# EasyEDA schematic STM32F103C8T6.json
TITLE: STM32F103C8T6; REV: 1.0; Date: 2023-01-12; Sheet: 1/1; Drawn By: Saw123; Company: Your Company
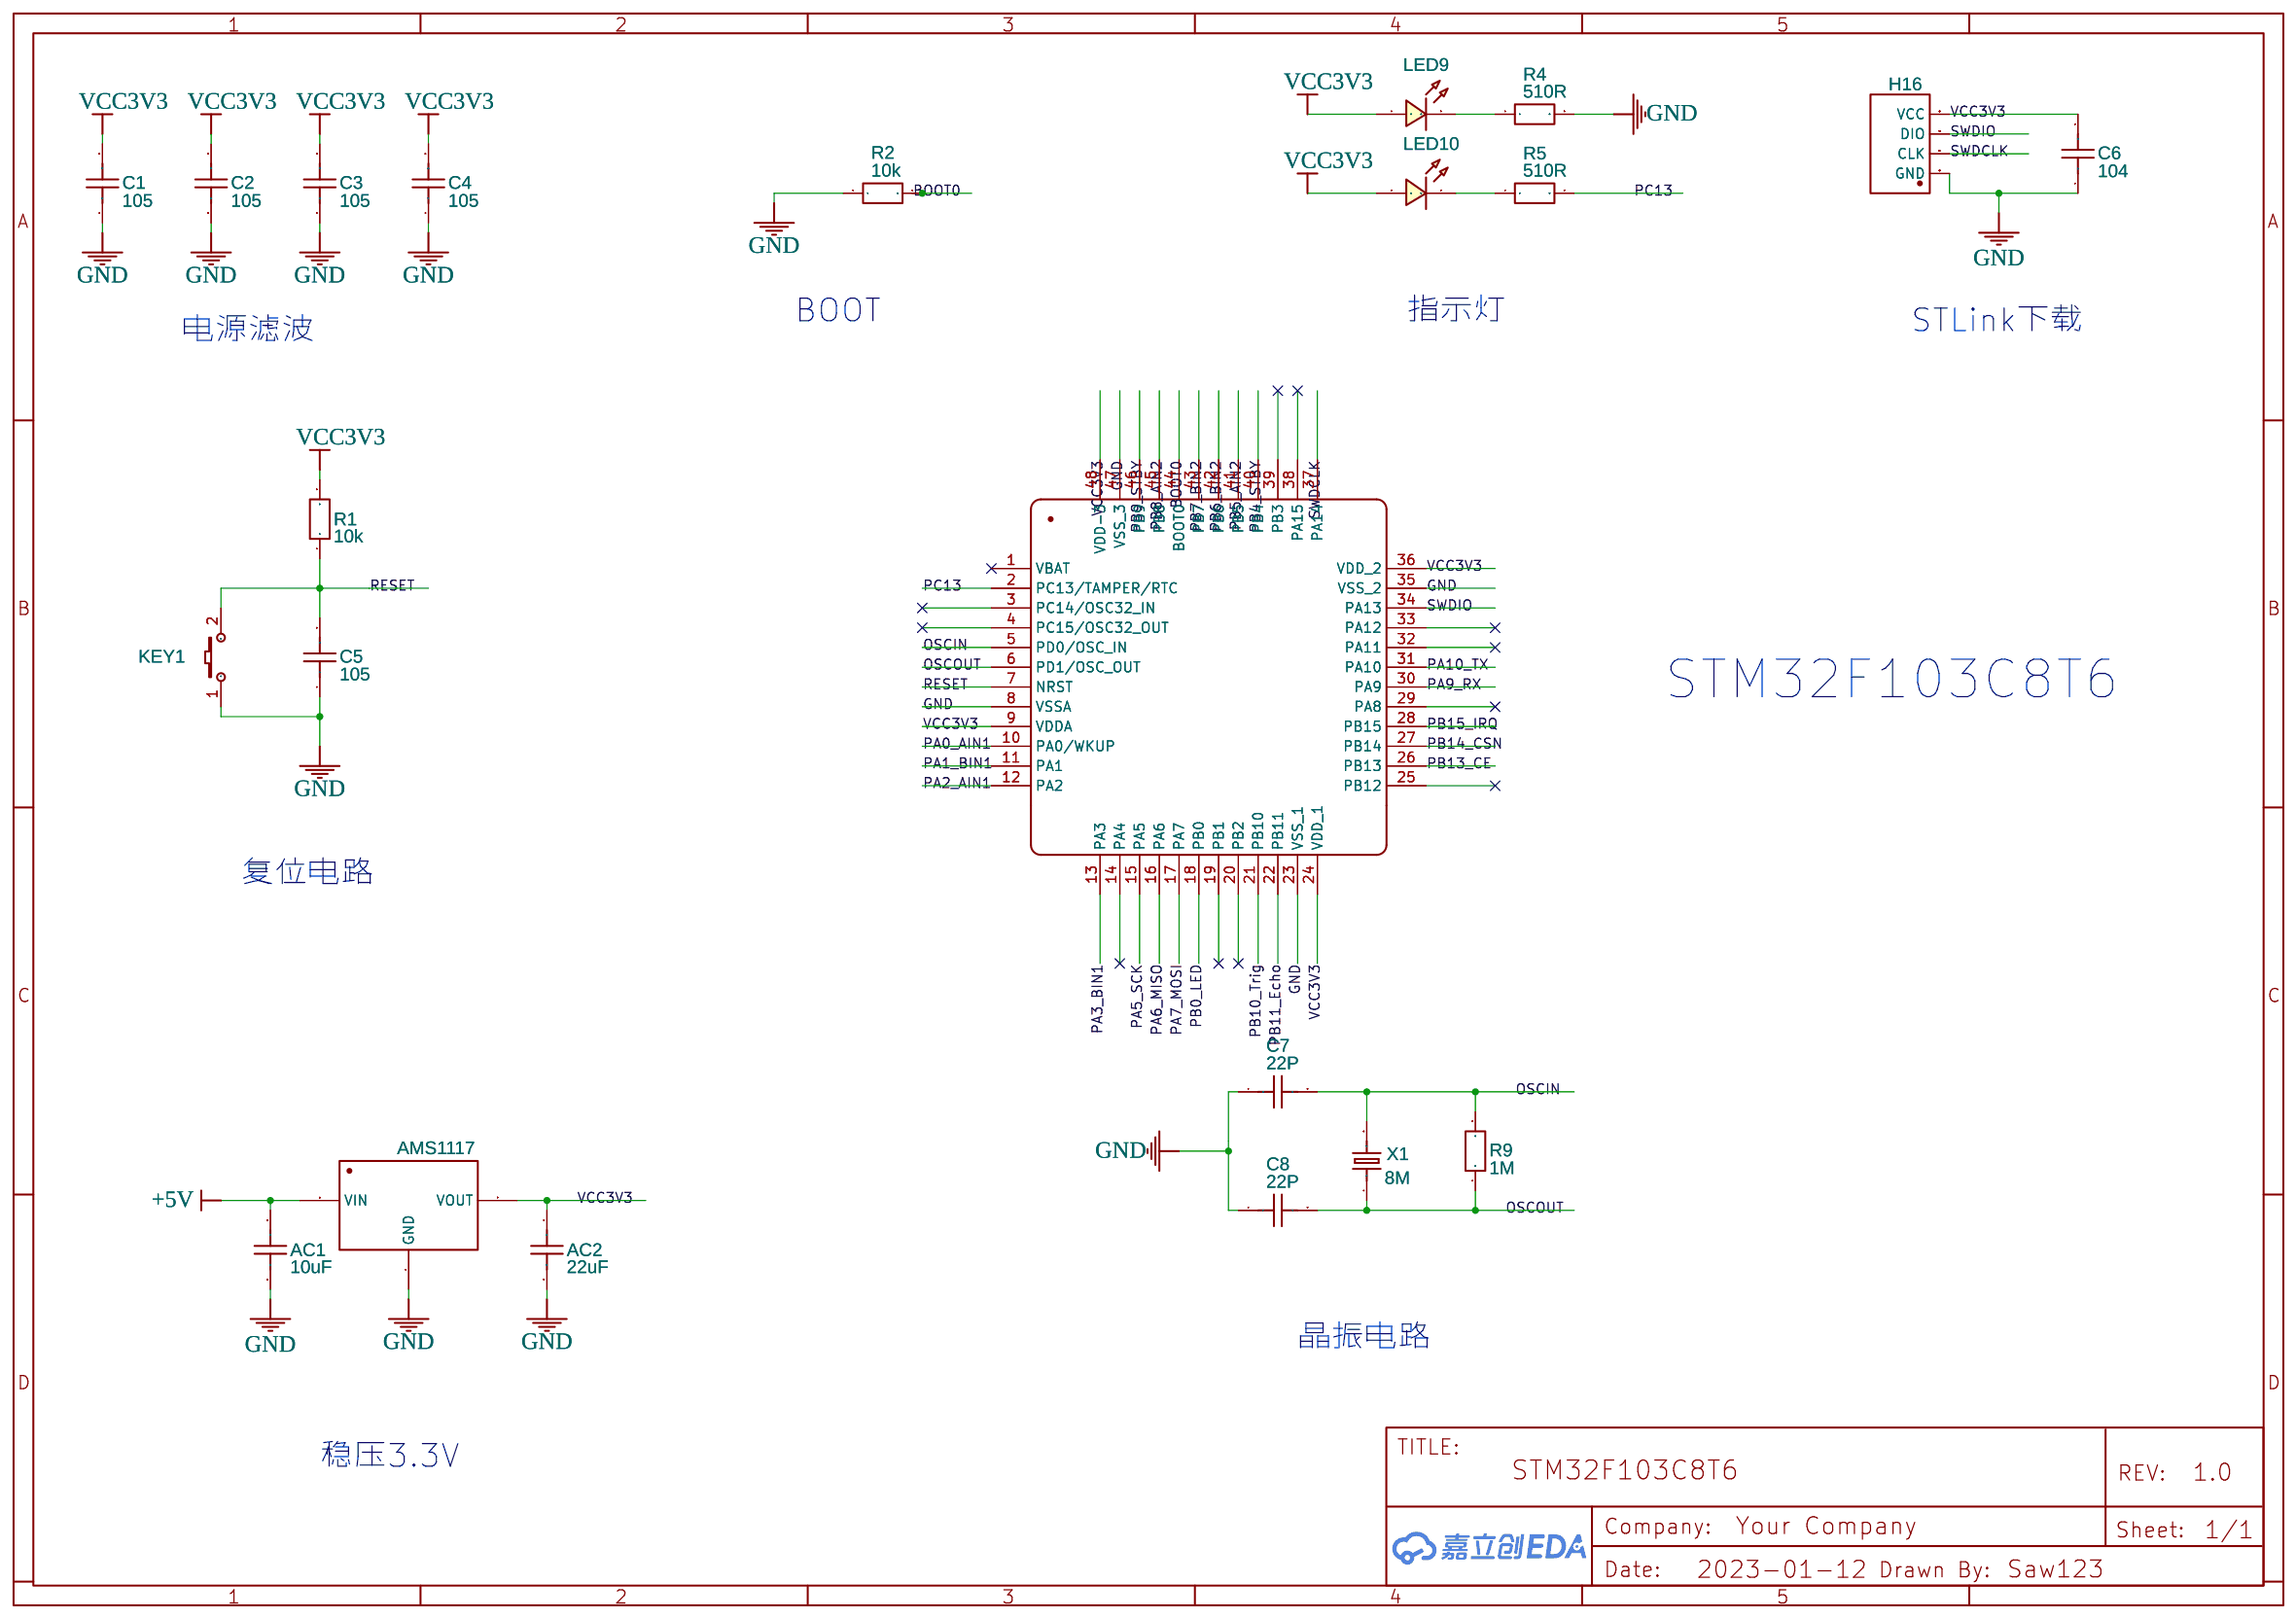
[diagram p0: schematic sheet]

## Parts
AC1  10uF  [C0805]
AC2  22uF  [C0805]
AU1  AMS1117  [AMS1117-3.3]
C1  105  [C0805]
C2  105  [C0805]
C3  105  [C0805]
C4  105  [C0805]
C5  105  [C0805]
C6  104  [C0805]
C7  22P  [C0805]
C8  22P  [C0805]
H16  STlink  [STLINK]
KEY1  K2-3.6×6.1_SMD  [KEY-SMD_2P-L6.2-W3.6-LS8.0]
LED9  LED-0805_R  [LED0805_RED]
LED10  LED-0805_G  [LED0805_GREEN]
R1  10k  [R0805]
R2  10k  [R0805]
R4  510R  [R0805]
R5  510R  [R0805]
R9  1M  [R0805]
U1  STM32F103C8T6  [STM32F103C8T6LQFP-48_L7.0-W7.0-P0.50-LS9.0-BL]
X1  8M  [HC-49US_L11.5-W4.5-P4.88]

## Library data of the parts
AC1 AC2 C1-C8 = C_0805_US: Contributor: LCEDA_Lib
AU1 = AMS1117: Contributor: Saw123
H16 = STlink: Contributor: Saw123
KEY1 = K2-3.6×6.1_SMD: Supplier Part: C118141; Supplier: LCSC; Manufacturer Part: K2-1107ST-A4SW-06; Contributor: LCEDA_Lib; 制造商: 韩国韩荣
LED9 = LED-0805_R: Manufacturer: EVERLIGHT(台湾亿光); Manufacturer Part: 17-21SURC/S530-A3/TR8; Supplier Part: C72037; Contributor: LCEDA_Lib
LED10 = LED-0805_G: Manufacturer: 国星光电; Manufacturer Part: NCD0805G1; Supplier Part: C84260; Contributor: LCEDA_Lib
R1 R2 R4 R5 R9 = R_0805_EU: Contributor: LCEDA_Lib
U1 = STM32F103C8T6: Supplier: LCSC; Contributor: Saw123
X1 = XIHCELNANF-8MHZ: Supplier: LCSC; Supplier Part: C295088; Manufacturer: TAITIEN Elec; Contributor: LCSC; JLCPCB Part Class: Extended Part

## Nets
+5V: AC1.1 AU1.3(VIN)
GND: AC1.2 AC2.2 AU1.1(GND) C1.1 C2.1 C3.1 C4.1 C5.1 C6.1 C7.1 C8.1 H16.GND KEY1.1 R2.1 R4.2 U1.8(VSSA) U1.23(VSS_1) U1.35(VSS_2) U1.47(VSS_3)
VCC3V3: AC2.1 AU1.2(VOUT) C1.2 C2.2 C3.2 C4.2 C6.2 H16.VCC LED9.1 LED10.1 R1.2 U1.9(VDDA) U1.24(VDD_1) U1.36(VDD_2) U1.48(VDD-3)
BOOT0: R2.2 U1.44(BOOT0)
OSCIN: C7.2 R9.2 U1.5(PD0/OSC_IN) X1.2
OSCOUT: C8.2 R9.1 U1.6(PD1/OSC_OUT) X1.1
PA0_AIN1: U1.10(PA0/WKUP)
PA1_BIN1: U1.11(PA1)
PA2_AIN1: U1.12(PA2)
PA3_BIN1: U1.13(PA3)
PA5_SCK: U1.15(PA5)
PA6_MISO: U1.16(PA6)
PA7_MOSI: U1.17(PA7)
PA9_RX: U1.30(PA9)
PA10_TX: U1.31(PA10)
PB0_LED: U1.18(PB0)
PB4_STBY: U1.40(PB4)
PB5_AIN2: U1.41(PB5)
PB6_BIN2: U1.42(PB6)
PB7_BIN2: U1.43(PB7)
PB8_AIN2: U1.45(PB8)
PB9_STBY: U1.46(PB9)
PB10_Trig: U1.21(PB10)
PB11_Echo: U1.22(PB11)
PB13_CE: U1.26(PB13)
PB14_CSN: U1.27(PB14)
PB15_IRQ: U1.28(PB15)
PC13: R5.2 U1.2(PC13/TAMPER/RTC)
RESET: C5.2 KEY1.2 R1.1 U1.7(NRST)
SWDCLK: H16.CLK U1.37(PA14)
SWDIO: H16.DIO U1.34(PA13)
Net-(LED9-2): LED9.2 R4.1
Net-(LED10-2): LED10.2 R5.1

Not connected (* = marked no-connect by the designer): U1 1(VBAT)* 3(PC14/OSC32_IN) 4(PC15/OSC32_OUT) 14(PA4) 19(PB1) 20(PB2) 25(PB12) 29(PA8) 32(PA11) 33(PA12) 38(PA15) 39(PB3)

## Notes on the sheet
- BOOT
- 指示灯
- 电源滤波
- STLink下载
- STM32F103C8T6
- 复位电路
- 晶振电路
- 稳压3.3V
